# EAGLE schematic interconnects (EAGLE 7.5.0)
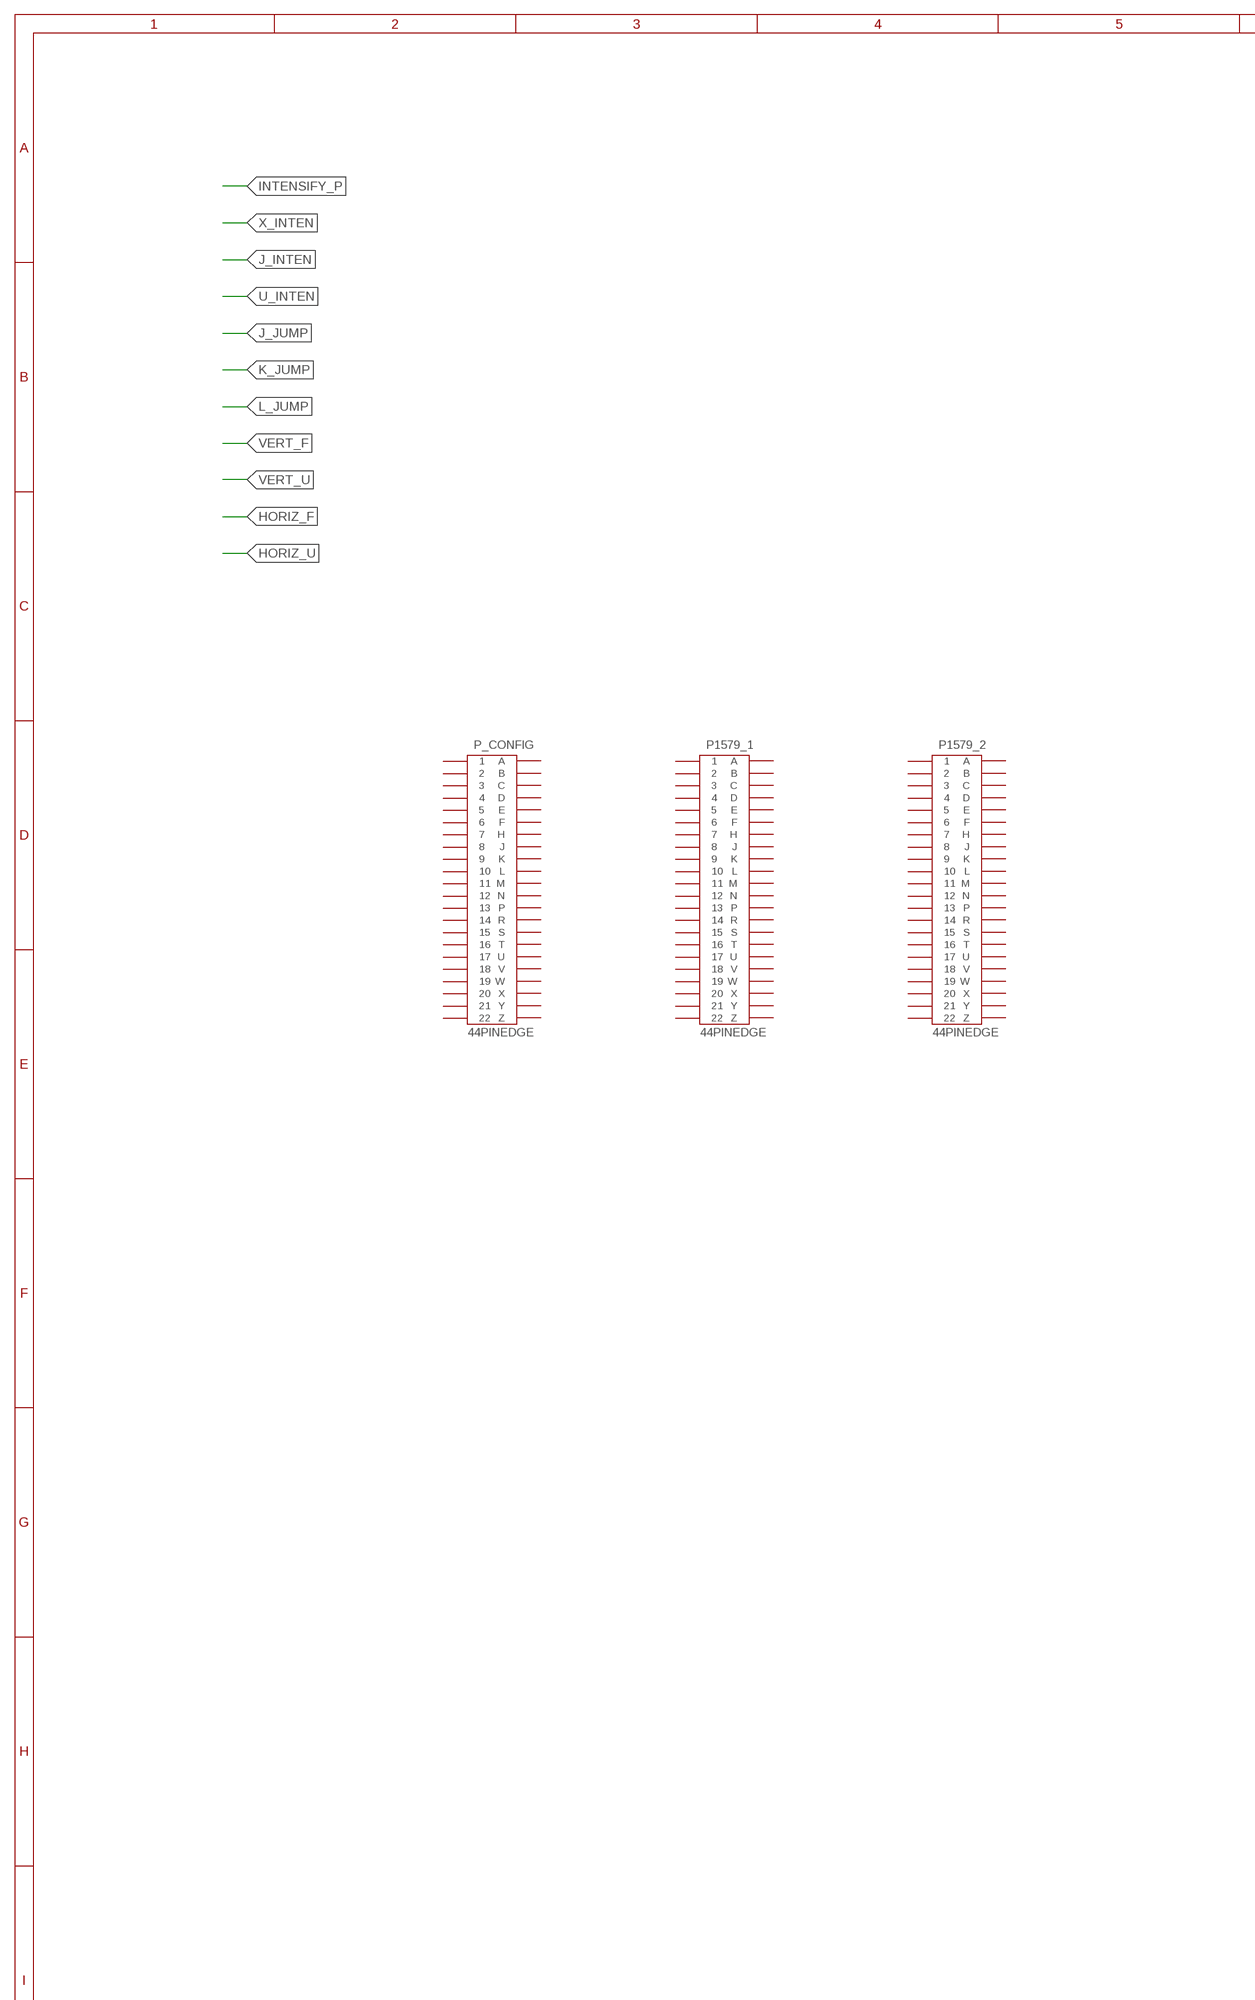
[diagram p0: schematic, sheet 1, part 1 of 2]
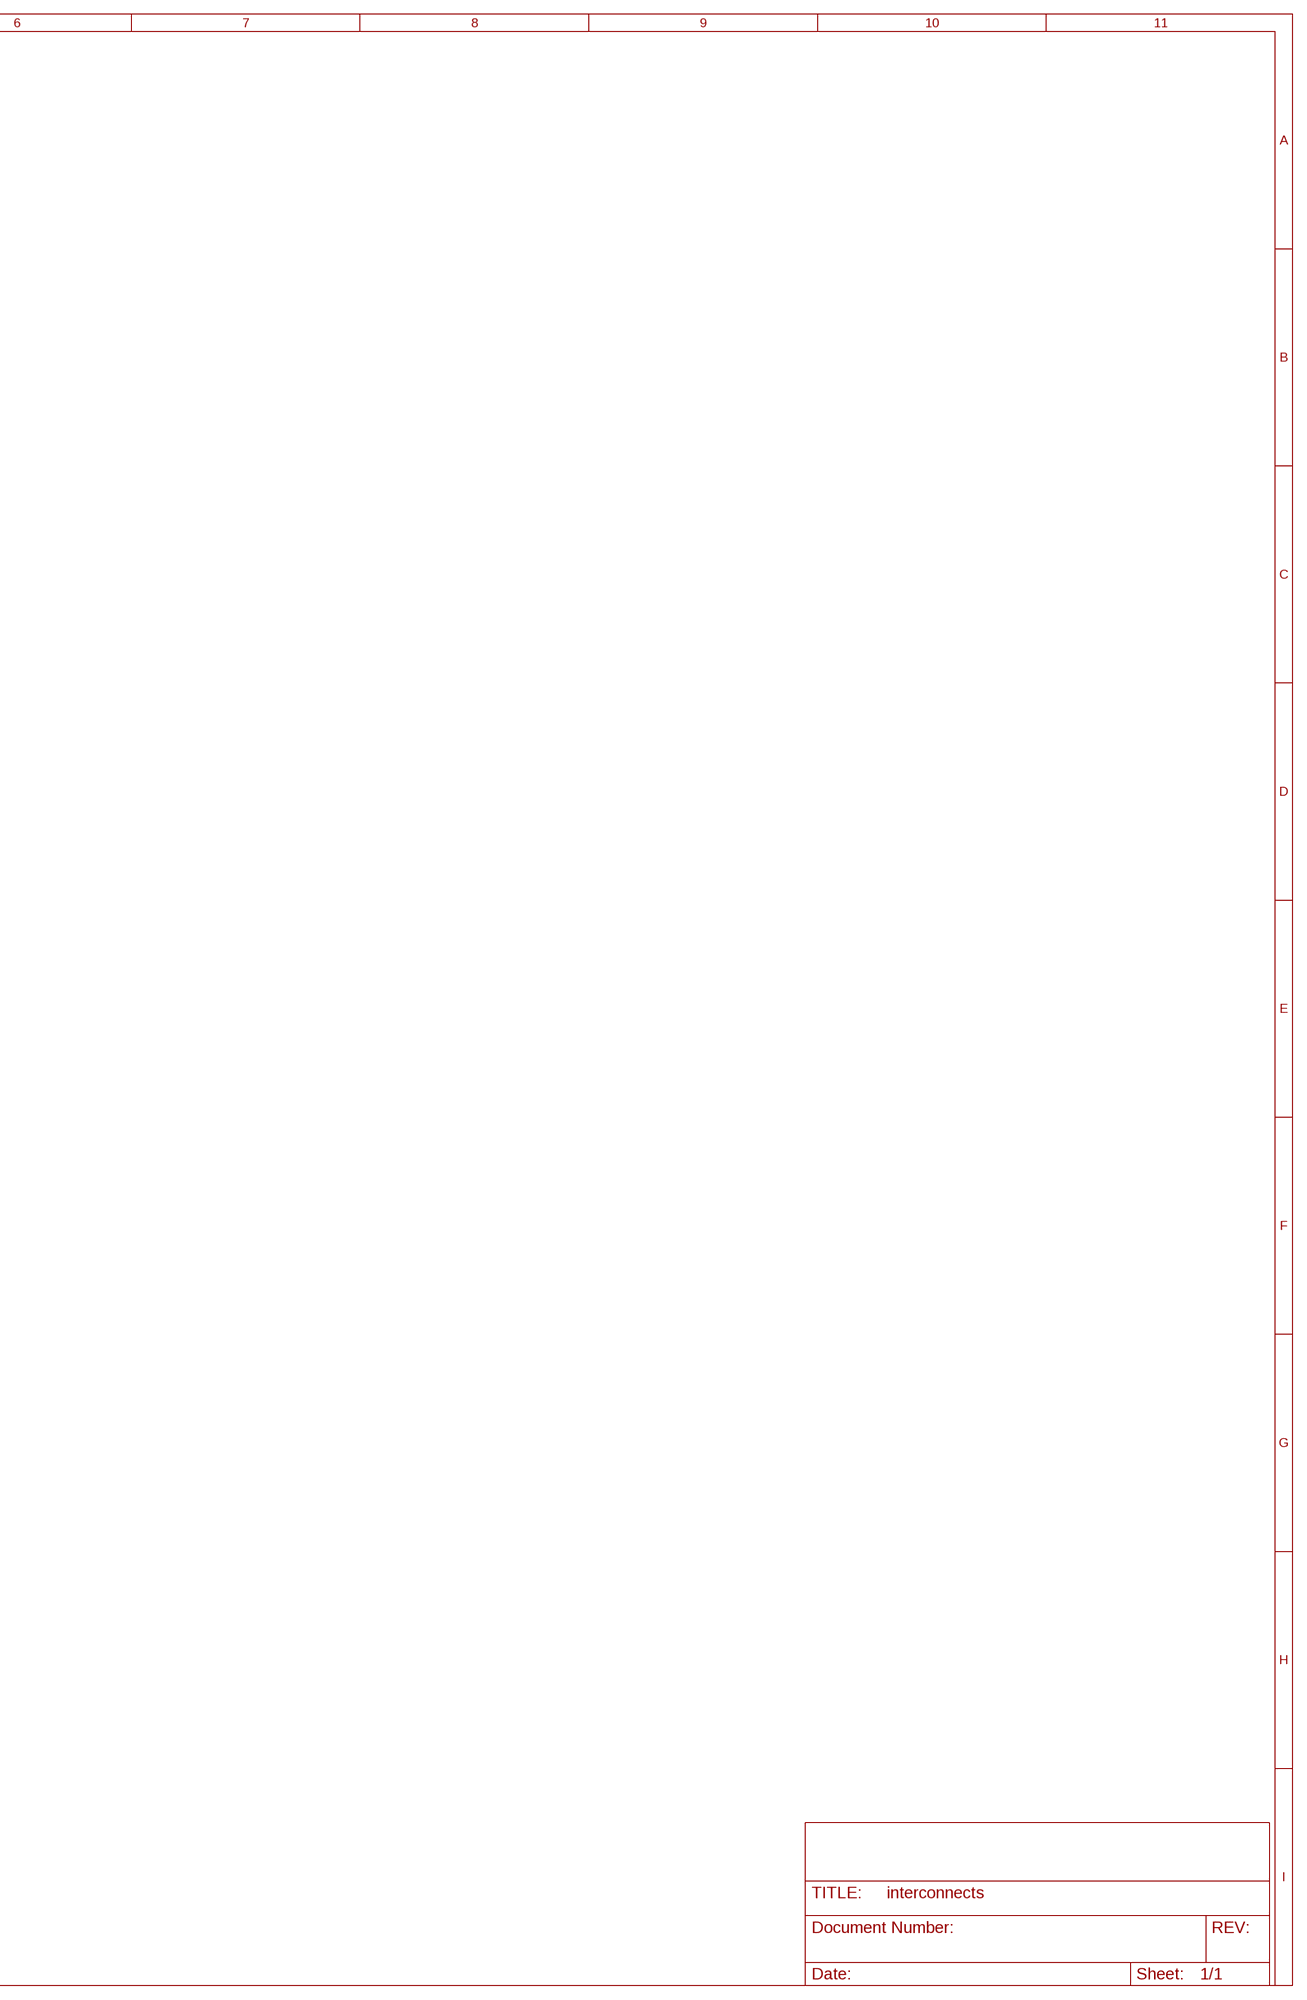
[diagram p1: schematic, sheet 1, part 2 of 2]

## Parts
P1579_1  44PINEDGE  [44PINEDGE]
P1579_2  44PINEDGE  [44PINEDGE]
P_CONFIG  44PINEDGE  [44PINEDGE]
Unconnected: P1579_1.1 P1579_1.2 P1579_1.3 P1579_1.4 P1579_1.5 P1579_1.6 P1579_1.7 P1579_1.8 P1579_1.9 P1579_1.10 P1579_1.11 P1579_1.12 P1579_1.13 P1579_1.14 P1579_1.15 P1579_1.16 P1579_1.17 P1579_1.18 P1579_1.19 P1579_1.20 P1579_1.21 P1579_1.22 P1579_1.A P1579_1.B P1579_1.C P1579_1.D P1579_1.E P1579_1.F P1579_1.H P1579_1.J P1579_1.K P1579_1.L P1579_1.M P1579_1.N P1579_1.P P1579_1.R P1579_1.S P1579_1.T P1579_1.U P1579_1.V P1579_1.W P1579_1.X P1579_1.Y P1579_1.Z P1579_2.1 P1579_2.2 P1579_2.3 P1579_2.4 P1579_2.5 P1579_2.6 P1579_2.7 P1579_2.8 P1579_2.9 P1579_2.10 P1579_2.11 P1579_2.12 P1579_2.13 P1579_2.14 P1579_2.15 P1579_2.16 P1579_2.17 P1579_2.18 P1579_2.19 P1579_2.20 P1579_2.21 P1579_2.22 P1579_2.A P1579_2.B P1579_2.C P1579_2.D P1579_2.E P1579_2.F P1579_2.H P1579_2.J P1579_2.K P1579_2.L P1579_2.M P1579_2.N P1579_2.P P1579_2.R P1579_2.S P1579_2.T P1579_2.U P1579_2.V P1579_2.W P1579_2.X P1579_2.Y P1579_2.Z P_CONFIG.1 P_CONFIG.2 P_CONFIG.3 P_CONFIG.4 P_CONFIG.5 P_CONFIG.6 P_CONFIG.7 P_CONFIG.8 P_CONFIG.9 P_CONFIG.10 P_CONFIG.11 P_CONFIG.12 P_CONFIG.13 P_CONFIG.14 P_CONFIG.15 P_CONFIG.16 P_CONFIG.17 P_CONFIG.18 P_CONFIG.19 P_CONFIG.20 P_CONFIG.21 P_CONFIG.22 P_CONFIG.A P_CONFIG.B P_CONFIG.C P_CONFIG.D P_CONFIG.E P_CONFIG.F P_CONFIG.H P_CONFIG.J P_CONFIG.K P_CONFIG.L P_CONFIG.M P_CONFIG.N P_CONFIG.P P_CONFIG.R P_CONFIG.S P_CONFIG.T P_CONFIG.U P_CONFIG.V P_CONFIG.W P_CONFIG.X P_CONFIG.Y P_CONFIG.Z

## Library data of the parts
P1579_1 P1579_2 P_CONFIG = keiths:44PINEDGE: 44 PIN EDGE CONNECTOR FOR PCB